# Altium project PROC154E3_SCH.PrjPcb (part 9 of 60)

## Sheet 16. SOC MCU OSPI0 FLASH.SchDoc: SOC - MCU OSPI FLASH
size 513 x 386 mm; Project: PROC154E2(001)_SK_AM69; Issue: 1.0; RevCode: E3; Page Create Date: March  8, 1995; Variant Name: Core Design; Schematic Page Number: 16; Page Number: 16; Page Size: C; Comment: MISTRAL_TITLEBLK_CSIZE_1; Page Count: 62; Schematic Page Count: 62; Name: PROC154E2 001 SK AM69; DsnPath: C:\Users\danie\Downloads\sprr466c\PROC154E3_RP\PROC154E3_SCH.DSN; SchematicName: SCHEMATIC1; PageName: 16. SOC MCU OSPI0 FLASH; PageSize: C; TopSchematic: True
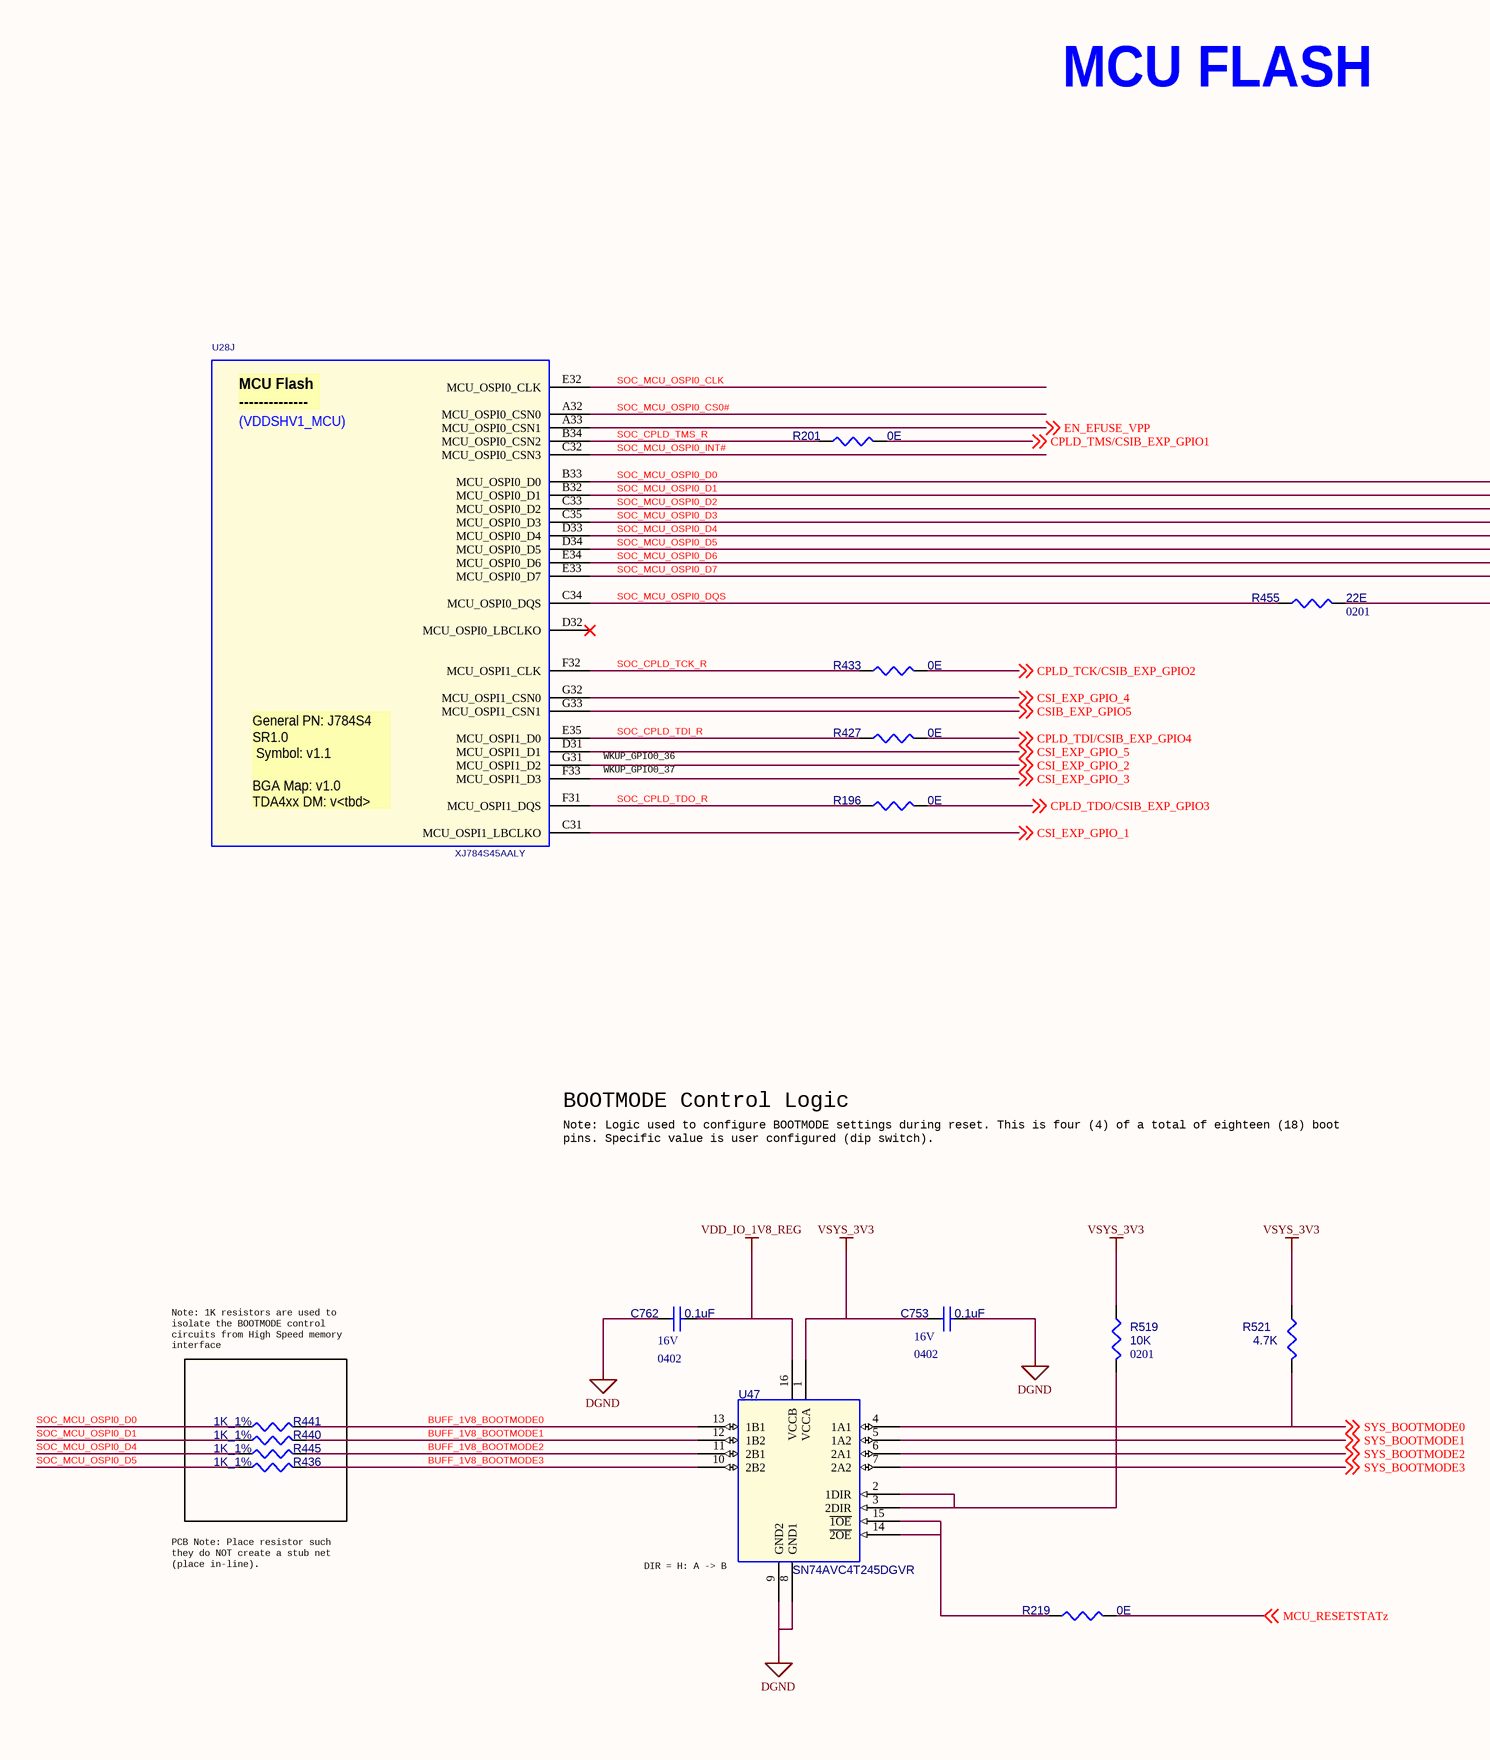
[diagram p22: 16. SOC MCU OSPI0 FLASH.SchDoc, left]
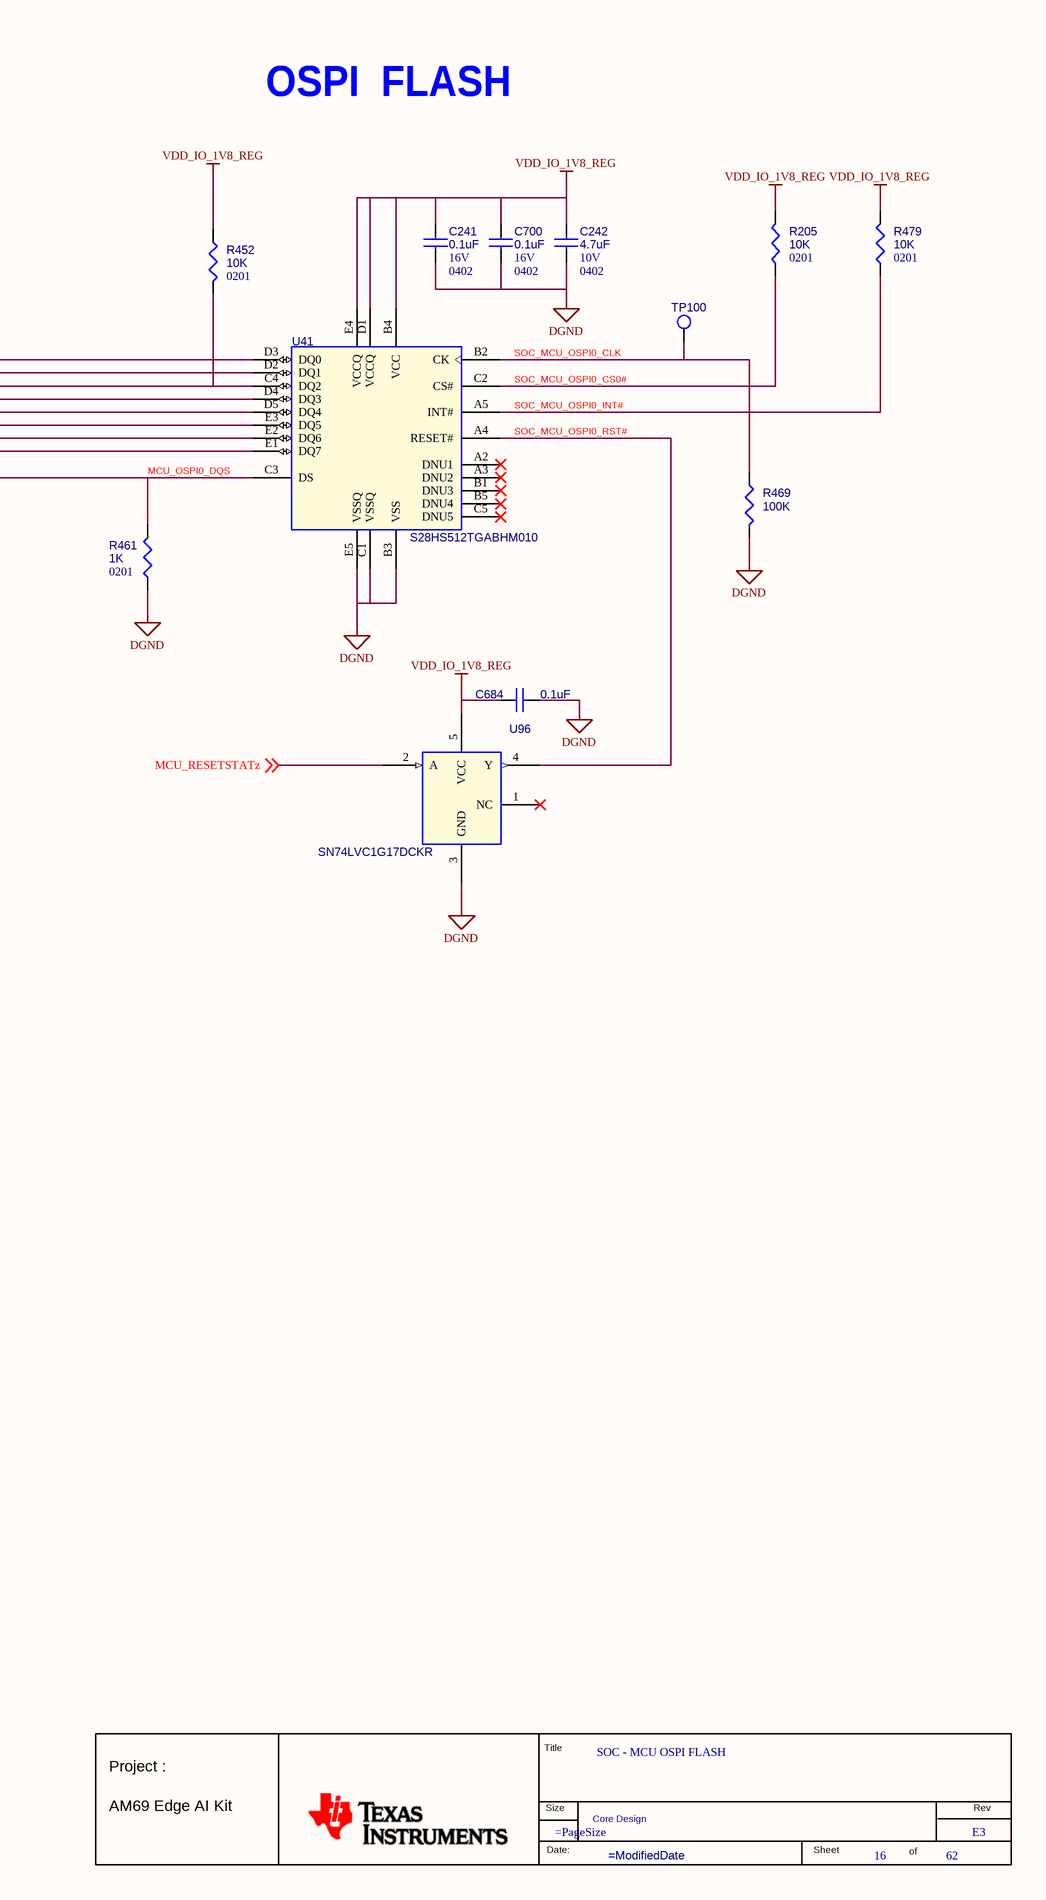
[diagram p23: 16. SOC MCU OSPI0 FLASH.SchDoc, right]

### Parts
(Parts that share a designator on the sheet are numbered #1, #2 ... from top to bottom, then left to right.)
*#16  RevCode: E3  Title: SOC - MCU OSPI FLASH  Page Number: 16  Page Count: 62  Variant Name: Core Design  (hidden comment: MISTRAL_TITLEBLK_CSIZE_1)  (graphical)
C241  0.1uF  Package: 0402  Voltage: 16V  [CAP0402_0-75]
C242  4.7uF  Voltage: 10V  Package: 0402  [CAP0402_0-75]
C684  0.1uF  [CAP0201_0-5]
C700  0.1uF  Voltage: 16V  Package: 0402  [CAP0402_0-75]
C753  0.1uF  Package: 0402  Voltage: 16V  [CAP0402_0-75]
C762  0.1uF  Package: 0402  Voltage: 16V  [CAP0402_0-75]
R196  0E  [RES0402_0-5]
R201  0E  [RES0402_0-5]
R205  10K  Package: 0201  [RES0201_0-5]
R219  0E  [RES0402_0-5]
R427  0E  [RES0402_0-5]
R433  0E  [RES0402_0-5]
R436  1K_1%  [RES0201_0-5]
R440  1K_1%  [RES0201_0-5]
R441  1K_1%  [RES0201_0-5]
R445  1K_1%  [RES0201_0-5]
R452  10K  Package: 0201  [RES0201_0-5]
R455  22E  Package: 0201  [RES0201_0-5]
R461  1K  Package: 0201  [RES0201_0-5]
R469  100K  [RES0402_0-5]
R479  10K  Package: 0201  [RES0201_0-5]
R519  10K  Package: 0201  [RES0201_0-5]
R521  4.7K  [RES0201_0-5]
TP100  TP30_SMD  [TP30_SMD]  (value not drawn)
U28  XJ784S45AALY  [BGA1414_31-49_1230X1230_2-7]  (part J of 26)
U41  S28HS512TGABHM010  [BGA24_39-37_240X310_1]
U47  SN74AVC4T245DGVR  [TVSOP16_15-74_150X180]
U96  SN74LVC1G17DCKR  [SC70-5]

### Nets
DGND: C241.2 C242.2 C684.2 C700.2 C753.2 C762.1 R461.1 R469.2 U41.B3(VSS) U41.C1(VSSQ) U41.E5(VSSQ) U47.8(GND1) U47.9(GND2) U96.3(GND)  [project net VDD_CPU_HCPS_GOSNS]
VDD_IO_1V8_REG: C241.1 C242.1 C684.1 C700.1 C762.2 R205.2 R452.1 R479.2 U41.B4(VCC) U41.D1(VCCQ) U41.E4(VCCQ) U47.16(VCCB) U96.5(VCC)
VSYS_3V3: C753.1 R519.1 R521.2 U47.1(VCCA)  [project net V_3V3]
BUFF_1V8_BOOTMODE0: R441.1 U47.13(1B1)
BUFF_1V8_BOOTMODE1: R440.1 U47.12(1B2)
BUFF_1V8_BOOTMODE2: R445.1 U47.11(2B1)
BUFF_1V8_BOOTMODE3: R436.1 U47.10(2B2)
CPLD_TCK/CSIB_EXP_GPIO2: R433.2 ; off-sheet CPLD_TCK/CSIB_EXP_GPIO2
CPLD_TDI/CSIB_EXP_GPIO4: R427.2 ; off-sheet CPLD_TDI/CSIB_EXP_GPIO4
CPLD_TDO/CSIB_EXP_GPIO3: R196.2 ; off-sheet CPLD_TDO/CSIB_EXP_GPIO3
CPLD_TMS/CSIB_EXP_GPIO1: R201.2 ; off-sheet CPLD_TMS/CSIB_EXP_GPIO1
CSI_EXP_GPIO_1: U28.C31(MCU_OSPI1_LBCLKO) ; off-sheet CSI_EXP_GPIO_1
CSI_EXP_GPIO_2: U28.G31(MCU_OSPI1_D2) ; off-sheet CSI_EXP_GPIO_2
CSI_EXP_GPIO_3: U28.F33(MCU_OSPI1_D3) ; off-sheet CSI_EXP_GPIO_3
CSI_EXP_GPIO_4: U28.G32(MCU_OSPI1_CSN0) ; off-sheet CSI_EXP_GPIO_4
CSI_EXP_GPIO_5: U28.D31(MCU_OSPI1_D1) ; off-sheet CSI_EXP_GPIO_5
CSIB_EXP_GPIO5: U28.G33(MCU_OSPI1_CSN1) ; off-sheet CSIB_EXP_GPIO5
EN_EFUSE_VPP: U28.A33(MCU_OSPI0_CSN1) ; off-sheet EN_EFUSE_VPP
MCU_OSPI0_DQS: R455.2 R461.2 U41.C3(DS)
MCU_RESETSTATZ: R219.2 U96.2(A) ; off-sheet MCU_RESETSTATz
SOC_CPLD_TCK_R: R433.1 U28.F32(MCU_OSPI1_CLK)
SOC_CPLD_TDI_R: R427.1 U28.E35(MCU_OSPI1_D0)
SOC_CPLD_TDO_R: R196.1 U28.F31(MCU_OSPI1_DQS)
SOC_CPLD_TMS_R: R201.1 U28.B34(MCU_OSPI0_CSN2)
SOC_MCU_OSPI0_CLK: R469.1 TP100.1(TP) U28.E32(MCU_OSPI0_CLK) U41.B2(CK)
SOC_MCU_OSPI0_CS0#: R205.1 U28.A32(MCU_OSPI0_CSN0) U41.C2(CS#)
SOC_MCU_OSPI0_D0: R441.2 U28.B33(MCU_OSPI0_D0) U41.D3(DQ0)
SOC_MCU_OSPI0_D1: R440.2 U28.B32(MCU_OSPI0_D1) U41.D2(DQ1)
SOC_MCU_OSPI0_D2: R452.2 U28.C33(MCU_OSPI0_D2) U41.C4(DQ2)
SOC_MCU_OSPI0_D3: U28.C35(MCU_OSPI0_D3) U41.D4(DQ3)
SOC_MCU_OSPI0_D4: R445.2 U28.D33(MCU_OSPI0_D4) U41.D5(DQ4)
SOC_MCU_OSPI0_D5: R436.2 U28.D34(MCU_OSPI0_D5) U41.E3(DQ5)
SOC_MCU_OSPI0_D6: U28.E34(MCU_OSPI0_D6) U41.E2(DQ6)
SOC_MCU_OSPI0_D7: U28.E33(MCU_OSPI0_D7) U41.E1(DQ7)
SOC_MCU_OSPI0_DQS: R455.1 U28.C34(MCU_OSPI0_DQS)
SOC_MCU_OSPI0_INT#: R479.1 U28.C32(MCU_OSPI0_CSN3) U41.A5(INT#)
SOC_MCU_OSPI0_RST#: U41.A4(RESET#) U96.4(Y)
SYS_BOOTMODE0: R521.1 U47.4(1A1) ; off-sheet SYS_BOOTMODE0
SYS_BOOTMODE1: U47.5(1A2) ; off-sheet SYS_BOOTMODE1
SYS_BOOTMODE2: U47.6(2A1) ; off-sheet SYS_BOOTMODE2
SYS_BOOTMODE3: U47.7(2A2) ; off-sheet SYS_BOOTMODE3
NetR219_1: R219.1 U47.14(~{2OE}) U47.15(~{1OE})
NetR519_2: R519.2 U47.2(1DIR) U47.3(2DIR)

Not connected (* = marked no-connect by the designer): U28 D32(MCU_OSPI0_LBCLKO)*; U41 A2(DNU1)* A3(DNU2)* B1(DNU3)* B5(DNU4)* C5(DNU5)*; U96 1(NC)*

### Notes on the sheet
- MCU FLASH
- OSPI  FLASH
- WKUP_GPIO0_36
- WKUP_GPIO0_37
- BOOTMODE Control Logic
- Note: Logic used to configure BOOTMODE settings during reset. This is four (4) of a total of eighteen (18) boot
  pins. Specific value is user configured (dip switch).
- Note: 1K resistors are used to
  isolate the BOOTMODE control
  circuits from High Speed memory
  interface
- PCB Note: Place resistor such
  they do NOT create a stub net
  (place in-line).
- (near U47) DIR = H: A -> B
- (in symbol J7AHPSoC-EVM_BGA1414, part J) MCU Flash / --------------; (VDDSHV1_MCU); General PN: J784S4 / SR1.0 / Symbol: v1.1 / BGA Map: v1.0 / TDA4xx DM: v<tbd>
- (in symbol MISTRAL_TITLEBLK_CSIZE_1) Title; Project :; Size; Rev; AM69 Edge AI Kit; Date:; Sheet; of

### Library data of the parts
*#16 = MISTRAL_TITLEBLK_CSIZE_1: Issue: 1.0; Project: PROC154E2(001)_SK_AM69; Name: PROC154E2 001 SK AM69; Page Create Date: March  8, 1995; Page Size: =PageSize; Page Modify Date: =ModifiedDate; Schematic Page Count: 62; Schematic Page Number: 16
C241 = CAP_Dup1: CAP CERAMIC 0.1uF 16V 10% X7R AUTO 0402; Part Reference: C241; Part_type: CAPACITORS\CERAMIC; Mfr_part_number: GCM155R71C104KA55D; Mfr_name: MURATA; Mistral Part No: 120016070006-R; Direct Alternate_mfr_part_number: GCM155R71C104JA55D; Automotive Alternate_mfr_name: TDK; Automotive Alternate_mfr_part_number: CGA2B1X7R1C104K050BC; Custom_Duty: 15%; Customs_HS_Code: 85322990; Wattage: NA; Project: DCMIST_FPGA_CARD; Value: 0.1uF; MECHANICAL 3D STEP FILE: CAP0402_0-75; Footprint Path: Y:\MIS_DATABASE\Library\ALTIUM_TOOL\PCB_FOOTPRINTS\Altium_Footprint_Lib.PcbLib; Library Path: Y:\MIS_DATABASE\Library\ALTIUM_TOOL\SCHEMATICS_PARTS\MS_DISCRETE_Library.schlib; Footprint Ref: CAP0402_0-75; Library Ref: CAP; Chkd/date: NAVEED/021014; Crtd /date: VASANTHA/300514; Datasheet: Y:\MIS_DATABASE\DATASHEETS\CAPACITORS\MURATA-GCM-SER.PDF; Temperature: -55°C+125°C; Weight: 6mg; Height: 0.55MM; Distributor_part_number: 490-4759-1-ND; Distributor_name: DIGIKEY; Tolerance: 10%; Direct Alternate_mfr_name: MURATA; PCB Footprint: CAP0402_0-75
C242 = CAP_Dup1: CAP CERAMIC 4.7uF 10V 20% X5R AUTO 0402; Part Reference: C242; Mistral Part No: 120021020032-R; Mfr_name: MURATA; Mfr_part_number: GRT155R61A475ME13D; Part_type: CAPACITORS\CERAMIC; Project: TI_DRA821 SK EVM BRD; Wattage: NA; Customs_HS_Code: 85322990; Custom_Duty: 15%; Value: 4.7uF; Footprint Path: Y:\MIS_DATABASE\Library\ALTIUM_TOOL\PCB_FOOTPRINTS\Altium_Footprint_Lib.PcbLib; Library Path: Y:\MIS_DATABASE\Library\ALTIUM_TOOL\SCHEMATICS_PARTS\MS_DISCRETE_Library.schlib; Footprint Ref: CAP0402_0-75; Tolerance: 20%; Distributor_name: MOUSER; Distributor_part_number: 81-GRT155R61A475ME13; Height: 0.65MM; Weight: 1.5mg; Temperature: -55°C+85°C; Datasheet: Y:\MIS_DATABASE\DATASHEETS\CAPACITORS\GRT155R61A475ME13.PDF; Crtd /date: ALVY/240221; Chkd/date: MANIRAJA/250221; MECHANICAL 3D STEP FILE: CAP0402_0-75; Library Ref: CAP; PCB Footprint: CAP0402_0-75
C684 = CAP_Dup1: CAP CERAMIC 0.1uF 16V 10% X7S AUTO 0201; Part Reference: C684; Mistral Part No: 120021030007-R; Mfr_name: MURATA; Mfr_part_number: GRT033C71C104KE01D; Part_type: CAPACITORS\CERAMIC; Project: J7ES_SK_BRD; Wattage: NA; Customs_HS_Code: 85322990; Custom_Duty: 15%; Value: 0.1uF; Tolerance: 10%; Voltage: 16V; Package: 0201; Distributor_name: DIGIKEY; Distributor_part_number: 490-GRT033C71C104KE01DTR-ND; Height: 0.33MM; Weight: 330mg; Temperature: -55°C+125°C; Datasheet: Y:\MIS_DATABASE\DATASHEETS\CAPACITORS\GRT033C71C104KE01.PDF; Crtd /date: ALVY/110321; Chkd/date: MANIRAJA/110321; MECHANICAL 3D STEP FILE: CAP0201_0-5; PCB Footprint: CAP0201_0-5
C700 = CAP_Dup1: CAP CERAMIC 0.1uF 16V 10% X7R AUTO 0402; Part Reference: C700; Mistral Part No: 120016070006-R; Mfr_name: MURATA; Mfr_part_number: GCM155R71C104KA55D; Part_type: CAPACITORS\CERAMIC; Direct Alternate_mfr_part_number: GCM155R71C104JA55D; Automotive Alternate_mfr_name: TDK; Automotive Alternate_mfr_part_number: CGA2B1X7R1C104K050BC; Project: DCMIST_FPGA_CARD; Wattage: NA; Customs_HS_Code: 85322990; Custom_Duty: 15%; Value: 0.1uF; MECHANICAL 3D STEP FILE: CAP0402_0-75; Tolerance: 10%; Distributor_name: DIGIKEY; Distributor_part_number: 490-4759-1-ND; Height: 0.55MM; Weight: 6mg; Temperature: -55°C+125°C; Datasheet: Y:\MIS_DATABASE\DATASHEETS\CAPACITORS\MURATA-GCM-SER.PDF; Crtd /date: VASANTHA/300514; Chkd/date: NAVEED/021014; Library Ref: CAP; Footprint Ref: CAP0402_0-75; Library Path: Y:\MIS_DATABASE\Library\ALTIUM_TOOL\SCHEMATICS_PARTS\MS_DISCRETE_Library.schlib; Footprint Path: Y:\MIS_DATABASE\Library\ALTIUM_TOOL\PCB_FOOTPRINTS\Altium_Footprint_Lib.PcbLib; Direct Alternate_mfr_name: MURATA; PCB Footprint: CAP0402_0-75
C753 = CAP_Dup1: CAP CERAMIC 0.1uF 16V 10% X7R AUTO 0402; Part Reference: C753; Automotive Alternate_mfr_part_number: CGA2B1X7R1C104K050BC; Automotive Alternate_mfr_name: TDK; Direct Alternate_mfr_part_number: GCM155R71C104JA55D; Direct Alternate_mfr_name: MURATA; Part_type: CAPACITORS\CERAMIC; Mfr_part_number: GCM155R71C104KA55D; Mistral Part No: 120016070006-R; Custom_Duty: 15%; Customs_HS_Code: 85322990; Wattage: NA; Project: DCMIST_FPGA_CARD; Value: 0.1uF; Footprint Path: Y:\MIS_DATABASE\Library\ALTIUM_TOOL\PCB_FOOTPRINTS\Altium_Footprint_Lib.PcbLib; Library Path: Y:\MIS_DATABASE\Library\ALTIUM_TOOL\SCHEMATICS_PARTS\MS_DISCRETE_Library.schlib; Footprint Ref: CAP0402_0-75; Library Ref: CAP; Chkd/date: NAVEED/021014; Crtd /date: VASANTHA/300514; Datasheet: Y:\MIS_DATABASE\DATASHEETS\CAPACITORS\MURATA-GCM-SER.PDF; Temperature: -55°C+125°C; Weight: 6mg; Height: 0.55MM; Distributor_part_number: 490-4759-1-ND; Distributor_name: DIGIKEY; Tolerance: 10%; Mfr_name: MURATA; MECHANICAL 3D STEP FILE: CAP0402_0-75; PCB Footprint: CAP0402_0-75
C762 = CAP_Dup1: CAP CERAMIC 0.1uF 16V 10% X7R AUTO 0402; Part Reference: C762; Part_type: CAPACITORS\CERAMIC; Mfr_part_number: GCM155R71C104KA55D; Mfr_name: MURATA; Mistral Part No: 120016070006-R; Direct Alternate_mfr_part_number: GCM155R71C104JA55D; Automotive Alternate_mfr_name: TDK; Automotive Alternate_mfr_part_number: CGA2B1X7R1C104K050BC; Custom_Duty: 15%; Customs_HS_Code: 85322990; Wattage: NA; Project: DCMIST_FPGA_CARD; Value: 0.1uF; MECHANICAL 3D STEP FILE: CAP0402_0-75; Footprint Path: Y:\MIS_DATABASE\Library\ALTIUM_TOOL\PCB_FOOTPRINTS\Altium_Footprint_Lib.PcbLib; Library Path: Y:\MIS_DATABASE\Library\ALTIUM_TOOL\SCHEMATICS_PARTS\MS_DISCRETE_Library.schlib; Footprint Ref: CAP0402_0-75; Library Ref: CAP; Chkd/date: NAVEED/021014; Crtd /date: VASANTHA/300514; Datasheet: Y:\MIS_DATABASE\DATASHEETS\CAPACITORS\MURATA-GCM-SER.PDF; Temperature: -55°C+125°C; Weight: 6mg; Height: 0.55MM; Distributor_part_number: 490-4759-1-ND; Distributor_name: DIGIKEY; Tolerance: 10%; Direct Alternate_mfr_name: MURATA; PCB Footprint: CAP0402_0-75
R196 = RESISTOR_Dup1: RES 0E 1/10W JUMPER 0402; Part Reference: R196; Mistral Part No: 110018030052-R; Mfr_name: PANASONIC-ECG; Mfr_part_number: ERJ-2GE0R00X; Part_type: RESISTORS\FIXED; Project: AEGIS POM; Tolerance: NA; Customs_HS_Code: 85332119; Custom_Duty: 15%; Value: 0E; MECHANICAL 3D STEP FILE: RES0402_0-5; Voltage: NA; Wattage: 1/10W; Package: 0402; Distributor_name: DIGIKEY; Distributor_part_number: P0.0JCT-ND; Height: 0.40MM; Weight: 0.8mg; Temperature: -55°C+155°C; Datasheet: Y:\MIS_DATABASE\DATASHEETS\RESISTORS\PAN-ERJSER_NOV17.PDF; Crtd /date: NAVEED/201014; Chkd/date: VASANTHA/061216; Library Ref: RESISTOR; Footprint Ref: RES0402_0-5; Library Path: Y:\MIS_DATABASE\Library\ALTIUM_TOOL\SCHEMATICS_PARTS\MS_DISCRETE_Library.schlib; Footprint Path: Y:\MIS_DATABASE\Library\ALTIUM_TOOL\PCB_FOOTPRINTS\Altium_Footprint_Lib.PcbLib; PCB Footprint: RES0402_0-5
R201 = RESISTOR_Dup1: RES 0E 1/10W JUMPER 0402; Part Reference: R201; Part_type: RESISTORS\FIXED; Mfr_part_number: ERJ-2GE0R00X; Mfr_name: PANASONIC-ECG; Mistral Part No: 110018030052-R; Custom_Duty: 15%; Customs_HS_Code: 85332119; Voltage: NA; Project: AEGIS POM; Value: 0E; Footprint Path: Y:\MIS_DATABASE\Library\ALTIUM_TOOL\PCB_FOOTPRINTS\Altium_Footprint_Lib.PcbLib; Library Path: Y:\MIS_DATABASE\Library\ALTIUM_TOOL\SCHEMATICS_PARTS\MS_DISCRETE_Library.schlib; Footprint Ref: RES0402_0-5; Library Ref: RESISTOR; Chkd/date: VASANTHA/061216; Crtd /date: NAVEED/201014; Datasheet: Y:\MIS_DATABASE\DATASHEETS\RESISTORS\PAN-ERJSER_NOV17.PDF; Temperature: -55°C+155°C; Weight: 0.8mg; Height: 0.40MM; Distributor_part_number: P0.0JCT-ND; Distributor_name: DIGIKEY; Package: 0402; Wattage: 1/10W; Tolerance: NA; MECHANICAL 3D STEP FILE: RES0402_0-5; PCB Footprint: RES0402_0-5
R205 = RESISTOR_Dup2: RES 10K 1/20W 5% 0201; Part Reference: R205; Mistral Part No: 110010070051-R; Mfr_name: YAGEO AMERICA; Mfr_part_number: RC0201JR-0710KL; Part_type: RESISTORS\FIXED; Project: GOLDEN-I LITE; Voltage: NA; Customs_HS_Code: 85332119; Custom_Duty: 15%; Value: 10K; Tolerance: 5%; Wattage: 1/20W; Distributor_name: DIGIKEY; Distributor_part_number: 311-10KNCT-ND; Height: 0.26MM; Weight: 0.17mg; Temperature: -55°C+125°C; Datasheet: Y:\MIS_DATABASE\DATASHEETS\RESISTORS\RCXXXXL-SER_MAR18.PDF; Crtd /date: MANIRAJA/050517; Chkd/date: MANIRAJA/050517; MECHANICAL 3D STEP FILE: RES0201_0-5; Library Ref: RESISTOR; Footprint Ref: RES0201_0-5; Library Path: Y:\MIS_DATABASE\Library\ALTIUM_TOOL\SCHEMATICS_PARTS\MS_DISCRETE_Library.schlib; Footprint Path: Y:\MIS_DATABASE\Library\ALTIUM_TOOL\PCB_FOOTPRINTS\Altium_Footprint_Lib.PcbLib; PCB Footprint: RES0201_0-5
R219 = RESISTOR_Dup1: RES 0E 1/10W JUMPER 0402; Part Reference: R219; Mistral Part No: 110018030052-R; Mfr_name: PANASONIC-ECG; Mfr_part_number: ERJ-2GE0R00X; Part_type: RESISTORS\FIXED; Project: AEGIS POM; Tolerance: NA; Customs_HS_Code: 85332119; Custom_Duty: 15%; Value: 0E; MECHANICAL 3D STEP FILE: RES0402_0-5; Voltage: NA; Wattage: 1/10W; Package: 0402; Distributor_name: DIGIKEY; Distributor_part_number: P0.0JCT-ND; Height: 0.40MM; Weight: 0.8mg; Temperature: -55°C+155°C; Datasheet: Y:\MIS_DATABASE\DATASHEETS\RESISTORS\PAN-ERJSER_NOV17.PDF; Crtd /date: NAVEED/201014; Chkd/date: VASANTHA/061216; Library Ref: RESISTOR; Footprint Ref: RES0402_0-5; Library Path: Y:\MIS_DATABASE\Library\ALTIUM_TOOL\SCHEMATICS_PARTS\MS_DISCRETE_Library.schlib; Footprint Path: Y:\MIS_DATABASE\Library\ALTIUM_TOOL\PCB_FOOTPRINTS\Altium_Footprint_Lib.PcbLib; PCB Footprint: RES0402_0-5
R427 = RESISTOR_Dup1: RES 0E 1/10W JUMPER 0402; Part Reference: R427; Mistral Part No: 110018030052-R; Mfr_name: PANASONIC-ECG; Mfr_part_number: ERJ-2GE0R00X; Part_type: RESISTORS\FIXED; Project: AEGIS POM; Tolerance: NA; Customs_HS_Code: 85332119; Custom_Duty: 15%; Value: 0E; MECHANICAL 3D STEP FILE: RES0402_0-5; Voltage: NA; Wattage: 1/10W; Package: 0402; Distributor_name: DIGIKEY; Distributor_part_number: P0.0JCT-ND; Height: 0.40MM; Weight: 0.8mg; Temperature: -55°C+155°C; Datasheet: Y:\MIS_DATABASE\DATASHEETS\RESISTORS\PAN-ERJSER_NOV17.PDF; Crtd /date: NAVEED/201014; Chkd/date: VASANTHA/061216; Library Ref: RESISTOR; Footprint Ref: RES0402_0-5; Library Path: Y:\MIS_DATABASE\Library\ALTIUM_TOOL\SCHEMATICS_PARTS\MS_DISCRETE_Library.schlib; Footprint Path: Y:\MIS_DATABASE\Library\ALTIUM_TOOL\PCB_FOOTPRINTS\Altium_Footprint_Lib.PcbLib; PCB Footprint: RES0402_0-5
R433 = RESISTOR_Dup1: RES 0E 1/10W JUMPER 0402; Part Reference: R433; Part_type: RESISTORS\FIXED; Mfr_part_number: ERJ-2GE0R00X; Mfr_name: PANASONIC-ECG; Mistral Part No: 110018030052-R; Custom_Duty: 15%; Customs_HS_Code: 85332119; Voltage: NA; Project: AEGIS POM; Value: 0E; Footprint Path: Y:\MIS_DATABASE\Library\ALTIUM_TOOL\PCB_FOOTPRINTS\Altium_Footprint_Lib.PcbLib; Library Path: Y:\MIS_DATABASE\Library\ALTIUM_TOOL\SCHEMATICS_PARTS\MS_DISCRETE_Library.schlib; Footprint Ref: RES0402_0-5; Library Ref: RESISTOR; Chkd/date: VASANTHA/061216; Crtd /date: NAVEED/201014; Datasheet: Y:\MIS_DATABASE\DATASHEETS\RESISTORS\PAN-ERJSER_NOV17.PDF; Temperature: -55°C+155°C; Weight: 0.8mg; Height: 0.40MM; Distributor_part_number: P0.0JCT-ND; Distributor_name: DIGIKEY; Package: 0402; Wattage: 1/10W; Tolerance: NA; MECHANICAL 3D STEP FILE: RES0402_0-5; PCB Footprint: RES0402_0-5
R436 = RESISTOR_Dup1: RES 1K 1/20W 1% 0201; Part Reference: R436; Mistral Part No: 110015080014-R; Mfr_name: KOA SPEER; Mfr_part_number: RK73H1HTTC1001F; Part_type: RESISTORS\FIXED; Voltage: NA; Project: HMC; Customs_HS_Code: 85332119; Custom_Duty: 15%; Value: 1K_1%; Footprint Path: Y:\MIS_DATABASE\Library\ALTIUM_TOOL\PCB_FOOTPRINTS\Altium_Footprint_Lib.PcbLib; Library Path: Y:\MIS_DATABASE\Library\ALTIUM_TOOL\SCHEMATICS_PARTS\MS_DISCRETE_Library.schlib; MECHANICAL 3D STEP FILE: RES0201_0-5; Footprint Ref: RES0201_0-5; Tolerance: 1%; Wattage: 1/20W; Package: 0201; Distributor_name: MOUSER; Distributor_part_number: 660-RK73H1HTTC1001F; Height: 0.26MM; Weight: 0.17mg; Temperature: -55°C+155°C; Datasheet: Y:\MIS_DATABASE\DATASHEETS\RESISTORS\RK73H-SER.PDF; Crtd /date: MAZHAR/100511; Chkd/date: RAGESH/120511; Library Ref: RESISTOR; Manufacturer: KOA SPEER; PCB Footprint: RES0201_0-5
R440 = RESISTOR_Dup1: RES 1K 1/20W 1% 0201; Part Reference: R440; Manufacturer: KOA SPEER; Part_type: RESISTORS\FIXED; Mfr_part_number: RK73H1HTTC1001F; Mistral Part No: 110015080014-R; Custom_Duty: 15%; Customs_HS_Code: 85332119; Project: HMC; Voltage: NA; Value: 1K_1%; Library Ref: RESISTOR; Chkd/date: RAGESH/120511; Crtd /date: MAZHAR/100511; Datasheet: Y:\MIS_DATABASE\DATASHEETS\RESISTORS\RK73H-SER.PDF; Temperature: -55°C+155°C; Weight: 0.17mg; Height: 0.26MM; Distributor_part_number: 660-RK73H1HTTC1001F; Distributor_name: MOUSER; Package: 0201; Wattage: 1/20W; Tolerance: 1%; Mfr_name: KOA SPEER; Footprint Ref: RES0201_0-5; MECHANICAL 3D STEP FILE: RES0201_0-5; Library Path: Y:\MIS_DATABASE\Library\ALTIUM_TOOL\SCHEMATICS_PARTS\MS_DISCRETE_Library.schlib; Footprint Path: Y:\MIS_DATABASE\Library\ALTIUM_TOOL\PCB_FOOTPRINTS\Altium_Footprint_Lib.PcbLib; PCB Footprint: RES0201_0-5
R441 = RESISTOR_Dup1: RES 1K 1/20W 1% 0201; Part Reference: R441; Manufacturer: KOA SPEER; Mistral Part No: 110015080014-R; Mfr_part_number: RK73H1HTTC1001F; Part_type: RESISTORS\FIXED; Voltage: NA; Project: HMC; Customs_HS_Code: 85332119; Custom_Duty: 15%; Value: 1K_1%; Footprint Path: Y:\MIS_DATABASE\Library\ALTIUM_TOOL\PCB_FOOTPRINTS\Altium_Footprint_Lib.PcbLib; Library Path: Y:\MIS_DATABASE\Library\ALTIUM_TOOL\SCHEMATICS_PARTS\MS_DISCRETE_Library.schlib; MECHANICAL 3D STEP FILE: RES0201_0-5; Footprint Ref: RES0201_0-5; Mfr_name: KOA SPEER; Tolerance: 1%; Wattage: 1/20W; Package: 0201; Distributor_name: MOUSER; Distributor_part_number: 660-RK73H1HTTC1001F; Height: 0.26MM; Weight: 0.17mg; Temperature: -55°C+155°C; Datasheet: Y:\MIS_DATABASE\DATASHEETS\RESISTORS\RK73H-SER.PDF; Crtd /date: MAZHAR/100511; Chkd/date: RAGESH/120511; Library Ref: RESISTOR; PCB Footprint: RES0201_0-5
R445 = RESISTOR_Dup1: RES 1K 1/20W 1% 0201; Part Reference: R445; Manufacturer: KOA SPEER; Part_type: RESISTORS\FIXED; Mfr_part_number: RK73H1HTTC1001F; Mistral Part No: 110015080014-R; Custom_Duty: 15%; Customs_HS_Code: 85332119; Project: HMC; Voltage: NA; Value: 1K_1%; Library Ref: RESISTOR; Chkd/date: RAGESH/120511; Crtd /date: MAZHAR/100511; Datasheet: Y:\MIS_DATABASE\DATASHEETS\RESISTORS\RK73H-SER.PDF; Temperature: -55°C+155°C; Weight: 0.17mg; Height: 0.26MM; Distributor_part_number: 660-RK73H1HTTC1001F; Distributor_name: MOUSER; Package: 0201; Wattage: 1/20W; Tolerance: 1%; Mfr_name: KOA SPEER; Footprint Ref: RES0201_0-5; MECHANICAL 3D STEP FILE: RES0201_0-5; Library Path: Y:\MIS_DATABASE\Library\ALTIUM_TOOL\SCHEMATICS_PARTS\MS_DISCRETE_Library.schlib; Footprint Path: Y:\MIS_DATABASE\Library\ALTIUM_TOOL\PCB_FOOTPRINTS\Altium_Footprint_Lib.PcbLib; PCB Footprint: RES0201_0-5
R452 = RESISTOR_Dup2: RES 10K 1/20W 5% 0201; Part Reference: R452; Mistral Part No: 110010070051-R; Mfr_name: YAGEO AMERICA; Mfr_part_number: RC0201JR-0710KL; Part_type: RESISTORS\FIXED; Project: GOLDEN-I LITE; Voltage: NA; Customs_HS_Code: 85332119; Custom_Duty: 15%; Value: 10K; Footprint Ref: RES0201_0-5; Tolerance: 5%; Wattage: 1/20W; Distributor_name: DIGIKEY; Distributor_part_number: 311-10KNCT-ND; Library Ref: RESISTOR; Height: 0.26MM; Weight: 0.17mg; Temperature: -55°C+125°C; Datasheet: Y:\MIS_DATABASE\DATASHEETS\RESISTORS\RCXXXXL-SER_MAR18.PDF; Crtd /date: MANIRAJA/050517; Chkd/date: MANIRAJA/050517; MECHANICAL 3D STEP FILE: RES0201_0-5; Library Path: Y:\MIS_DATABASE\Library\ALTIUM_TOOL\SCHEMATICS_PARTS\MS_DISCRETE_Library.schlib; Footprint Path: Y:\MIS_DATABASE\Library\ALTIUM_TOOL\PCB_FOOTPRINTS\Altium_Footprint_Lib.PcbLib; PCB Footprint: RES0201_0-5
R455 = RESISTOR_Dup2: RES 22E 1/20W 5% 0201; Part Reference: R455; Mistral Part No: 110020050041-R; Mfr_name: PANASONIC-ECG; Mfr_part_number: ERJ-1GNJ220C; Part_type: RESISTORS\FIXED; Project: QCS610_NANOSOM; Voltage: NA; Customs_HS_Code: 85332119; Custom_Duty: 15%; SIGNAL_MODEL: RESISTOR_RES0201_0-5_22E_22E; Value: 22E; Footprint Ref: RES0201_0-5; Tolerance: 5%; Wattage: 1/20W; Distributor_name: DIGIKEY; Distributor_part_number: P123275CT-ND; Library Ref: RESISTOR; Height: 0.26MM; Weight: 0.15mg; Temperature: -55°C+125°C; Datasheet: Y:\MIS_DATABASE\DATASHEETS\RESISTORS\PAN-ERJSER_NOV17.PDF; Crtd /date: ALVY/250520; Chkd/date: MANIRAJA/300520; MECHANICAL 3D STEP FILE: RES0201_0-5; Library Path: Y:\MIS_DATABASE\Library\ALTIUM_TOOL\SCHEMATICS_PARTS\MS_DISCRETE_Library.schlib; Footprint Path: Y:\MIS_DATABASE\Library\ALTIUM_TOOL\PCB_FOOTPRINTS\Altium_Footprint_Lib.PcbLib; PCB Footprint: RES0201_0-5
R461 = RESISTOR_Dup1: RES 1K 1/20W 5% 0201; Part Reference: R461; Part_type: RESISTORS\FIXED; Mfr_part_number: RC0201JR-071KL; Mfr_name: YAGEO AMERICA; Mistral Part No: 110009030395-R; Custom_Duty: 15%; Customs_HS_Code: 85332119; Project: GOLDEN-I LITE; Voltage: NA; Value: 1K; Library Ref: RESISTOR; Chkd/date: MANIRAJA/050517; Crtd /date: MANIRAJA/050517; Datasheet: Y:\MIS_DATABASE\DATASHEETS\RESISTORS\RCXXXXL-SER_MAR18.PDF; Temperature: -55°C+125°C; Weight: 0.17mg; Height: 0.26MM; Distributor_part_number: 311-1KNCT-ND; Distributor_name: DIGIKEY; Wattage: 1/20W; Tolerance: 5%; Footprint Ref: RES0201_0-5; MECHANICAL 3D STEP FILE: RES0201_0-5; Library Path: Y:\MIS_DATABASE\Library\ALTIUM_TOOL\SCHEMATICS_PARTS\MS_DISCRETE_Library.schlib; Footprint Path: Y:\MIS_DATABASE\Library\ALTIUM_TOOL\PCB_FOOTPRINTS\Altium_Footprint_Lib.PcbLib; PCB Footprint: RES0201_0-5
R469 = RESISTOR_Dup2: RES 100K 1/10W 5% 0402; Part Reference: R469; Mistral Part No: 110009030177-R; Mfr_name: PANASONIC-ECG; Mfr_part_number: ERJ-2GEJ104X; Part_type: RESISTORS\FIXED; Project: RED EYE; Voltage: NA; Customs_HS_Code: 85332119; Custom_Duty: 15%; Value: 100K; Footprint Ref: RES0402_0-5; Tolerance: 5%; Wattage: 1/10W; Package: 0402; Distributor_name: DIGIKEY; Distributor_part_number: P100KJCT-ND; Library Ref: RESISTOR; Height: 0.40MM; Weight: 0.8mg; Temperature: -55°C+155°C; Datasheet: Y:\MIS_DATABASE\DATASHEETS\RESISTORS\PAN-ERJSER_NOV17.PDF; Crtd /date: GEETHA/190406; Chkd/date: VASANTHA/291216; MECHANICAL 3D STEP FILE: RES0402_0-5; Library Path: Y:\MIS_DATABASE\Library\ALTIUM_TOOL\SCHEMATICS_PARTS\MS_DISCRETE_Library.schlib; Footprint Path: Y:\MIS_DATABASE\Library\ALTIUM_TOOL\PCB_FOOTPRINTS\Altium_Footprint_Lib.PcbLib; PCB Footprint: RES0402_0-5
R479 = RESISTOR_Dup2: RES 10K 1/20W 5% 0201; Part Reference: R479; Part_type: RESISTORS\FIXED; Mfr_part_number: RC0201JR-0710KL; Mfr_name: YAGEO AMERICA; Mistral Part No: 110010070051-R; Custom_Duty: 15%; Customs_HS_Code: 85332119; Voltage: NA; Project: GOLDEN-I LITE; Value: 10K; Footprint Path: Y:\MIS_DATABASE\Library\ALTIUM_TOOL\PCB_FOOTPRINTS\Altium_Footprint_Lib.PcbLib; Library Path: Y:\MIS_DATABASE\Library\ALTIUM_TOOL\SCHEMATICS_PARTS\MS_DISCRETE_Library.schlib; Footprint Ref: RES0201_0-5; Library Ref: RESISTOR; MECHANICAL 3D STEP FILE: RES0201_0-5; Chkd/date: MANIRAJA/050517; Crtd /date: MANIRAJA/050517; Datasheet: Y:\MIS_DATABASE\DATASHEETS\RESISTORS\RCXXXXL-SER_MAR18.PDF; Temperature: -55°C+125°C; Weight: 0.17mg; Height: 0.26MM; Distributor_part_number: 311-10KNCT-ND; Distributor_name: DIGIKEY; Wattage: 1/20W; Tolerance: 5%; PCB Footprint: RES0201_0-5
R519 = RESISTOR_Dup2: RES 10K 1/20W 5% 0201; Part Reference: R519; Part_type: RESISTORS\FIXED; Mfr_part_number: RC0201JR-0710KL; Mfr_name: YAGEO AMERICA; Mistral Part No: 110010070051-R; Custom_Duty: 15%; Customs_HS_Code: 85332119; Voltage: NA; Project: GOLDEN-I LITE; Value: 10K; Footprint Path: Y:\MIS_DATABASE\Library\ALTIUM_TOOL\PCB_FOOTPRINTS\Altium_Footprint_Lib.PcbLib; Library Path: Y:\MIS_DATABASE\Library\ALTIUM_TOOL\SCHEMATICS_PARTS\MS_DISCRETE_Library.schlib; MECHANICAL 3D STEP FILE: RES0201_0-5; Chkd/date: MANIRAJA/050517; Crtd /date: MANIRAJA/050517; Datasheet: Y:\MIS_DATABASE\DATASHEETS\RESISTORS\RCXXXXL-SER_MAR18.PDF; Temperature: -55°C+125°C; Weight: 0.17mg; Height: 0.26MM; Library Ref: RESISTOR; Distributor_part_number: 311-10KNCT-ND; Distributor_name: DIGIKEY; Wattage: 1/20W; Tolerance: 5%; Footprint Ref: RES0201_0-5; PCB Footprint: RES0201_0-5
R521 = RESISTOR_Dup2: RES 4.7K 1/20W 5% 0201; Part Reference: R521; Part_type: RESISTORS\FIXED; Mfr_part_number: ERJ-1GNJ472C; Mfr_name: PANASONIC-ECG; Mistral Part No: 110010070061-R; Custom_Duty: 15%; Customs_HS_Code: 85332119; Voltage: NA; Project: CUSTOM DCA1000; Value: 4.7K; Footprint Path: Y:\MIS_DATABASE\Library\ALTIUM_TOOL\PCB_FOOTPRINTS\Altium_Footprint_Lib.PcbLib; Library Path: Y:\MIS_DATABASE\Library\ALTIUM_TOOL\SCHEMATICS_PARTS\MS_DISCRETE_Library.schlib; MECHANICAL 3D STEP FILE: RES0201_0-5; Chkd/date: MANIRAJA/170420; Crtd /date: ALVY/170420; Datasheet: Y:\MIS_DATABASE\DATASHEETS\RESISTORS\PAN-ERJSER_NOV17.PDF; Temperature: -55°C+125°C; Weight: 0.15mg; Height: 0.26MM; Library Ref: RESISTOR; Distributor_part_number: P4.7AECT-ND; Distributor_name: DIGIKEY; Package: 0201; Wattage: 1/20W; Tolerance: 5%; Footprint Ref: RES0201_0-5; PCB Footprint: RES0201_0-5
TP100 = TESTPOINT_Dup1: TESTPOINT CIR 30 SMD; Part Reference: TP100; Mfr_name: LOCAL; Mistral Part No: 130009030930; Custom_Duty: NA; Project: BT MODULE_CSRBC04; Value: TP30_SMD; Customs_HS_Code: NA; RoHS: NA; Footprint Path: Y:\MIS_DATABASE\Library\ALTIUM_TOOL\PCB_FOOTPRINTS\Altium_Footprint_Lib.PcbLib; Library Path: Y:\MIS_DATABASE\Library\ALTIUM_TOOL\SCHEMATICS_PARTS\MS_DISCRETE_Library.schlib; MECHANICAL 3D STEP FILE: NA; Chkd/date: SHREESHAIL/171006; Crtd /date: MAZHAR/171006; Datasheet: NA; Temperature: NA; Weight: NA; Height: NA; Distributor_part_number: NA; Distributor_name: NA; Package: SMD; Wattage: NA; Voltage: NA; Tolerance: NA; Part_type: TESTPOINT; Mfr_part_number: TP30_SMD; Library Ref: TESTPOINT; Footprint Ref: TP30_SMD; PCB Footprint: TP30_SMD
U28 = J7AHPSoC-EVM_BGA1414: IC AM69 SoC EVM MICROPROCESSOR BGA1414; Part Reference: U28; Part_type: ICS\DIGITAL\MICROPROCESSOR; Mfr_name: TEXAS INSTRUMENTS; Mistral Part No: 141230020002; SPLIT_INST: TRUE; SWAP_INFO: (S1+S2+S3+S4+S5+S6+S7+S8+S9+S10+S11+S12+S13+S14+S15+S16+S17+S18+S19+S20+S21+S22+S23+S24+S25+S26); Custom_Duty: 15%; Customs_HS_Code: 85423100; Wattage: NA; Project: TI_J7AHP SK_BRD; Value: XJ784S45AALY; Footprint Path: Y:\MIS_DATABASE\Library\ALTIUM_TOOL\PCB_FOOTPRINTS\Altium_Footprint_Lib.PcbLib; Library Path: Y:\MIS_DATABASE\Library\ALTIUM_TOOL\SCHEMATICS_PARTS\MS_MICROPROCESSOR_Library.schlib; MECHANICAL 3D STEP FILE: BGA1414_31-49_1230X1230_2-7; RoHS: NA; Chkd/date: MANIRAJA/151221; Crtd /date: ALVY/141221; Datasheet: Y:\MIS_DATABASE\DATASHEETS\ICS\DIGITAL\MICROCONTROLLER\J7AHP-SoC-EVM.PDF; Temperature: NA; Weight: NA; Height: 2.70MM; Library Ref: J7AHPSoC-EVM_BGA1414; Distributor_part_number: NA; Distributor_name: NA; Package: BGA1414; Voltage: NA; Tolerance: NA; Mfr_part_number: XJ784S45AALY; Footprint Ref: BGA1414_31-49_1230X1230_2-7; Manufacturer: TEXAS INSTRUMENTS; PCB Footprint: BGA1414_31-49_1230X1230_2-7
U41 = S28HS512T_BGA24: IC 1.8V 512Mb SEMPER FLASH WITH OCTAL INTERFACE BGA24; Part Reference: U41; Part_type: ICS\DIGITAL\MEMORY; Mfr_name: CYPRESS SEMICONDUCTOR; Mistral Part No: 141120010002; Custom_Duty: 15%; Customs_HS_Code: 85423100; Wattage: NA; Project: J7VCL_SOM DUAL LEO PMIC; Value: S28HS512TGABHM010; Footprint Path: Y:\MIS_DATABASE\Library\ALTIUM_TOOL\PCB_FOOTPRINTS\Altium_Footprint_Lib.PcbLib; Library Path: Y:\MIS_DATABASE\Library\ALTIUM_TOOL\SCHEMATICS_PARTS\MS_MISCMEMORY_Library.schlib; MECHANICAL 3D STEP FILE: BGA24_39-37_240X310_1; RoHS: NA; Chkd/date: MANIRAJA/170120; Crtd /date: ALVY/170120; Datasheet: Y:\MIS_DATABASE\DATASHEETS\ICS\MEMORY\S28HS512T.PDF; Temperature: -40°C+125°C; Weight: NA; Height: 1.00MM; Library Ref: S28HS512T_BGA24; Distributor_part_number: NA; Distributor_name: NA; Package: BGA24; Voltage: NA; Tolerance: NA; Mfr_part_number: S28HS512TGABHM010; Footprint Ref: BGA24_39-37_240X310_1; PCB Footprint: BGA24_39-37_240X310_1
U47 = SN74AVC4T245DGVR_TVSOP16: IC 4-BIT DUAL SUPPLY BUS TRANSCEIVER TVSOP16; Part Reference: U47; Part_type: ICS\DIGITAL\COMBINATIONAL; Mfr_name: TEXAS INSTRUMENTS; Mistral Part No: 141009110005-P; Custom_Duty: 15%; Customs_HS_Code: 85423100; Project: GOLDEN-I; Value: SN74AVC4T245DGVR; RoHS: Sb/ Br FREE; Chkd/date: SUHAS/251010; Crtd /date: MAZHAR/201109; Datasheet: Y:\MIS_DATABASE\DATASHEETS\ICS\DIGITAL\BUSTRANSCEIVER\SN74AVC4T245.PDF; Temperature: -40°C+85°C; Height: 1.20MM; Library Ref: SN74AVC4T245DGVR_TVSOP16; Distributor_part_number: 296-18054-1-ND; Distributor_name: DIGIKEY; Package: TVSOP16; Mfr_part_number: SN74AVC4T245DGVR; PCB Footprint: TVSOP16_15-74_150X180
U96 = SN74LVC1G17DCKR_SC70-5: IC SINGLE SCHMITT-TRIGGER BUFFER SC70-5; Part Reference: U96; Part_type: ICS\DIGITAL\COMBINATIONAL; Mfr_name: TEXAS INSTRUMENTS; Mistral Part No: 141010110012-R; Automotive Alternate_mfr_part_number: SN74LVC1G17QDCKRQ1; Custom_Duty: 15%; Customs_HS_Code: 85423100; Wattage: NA; Project: ITS-PWR_CARD; Value: SN74LVC1G17DCKR; Chkd/date: MAZHAR/011210; Crtd /date: BAVISH/251110; Datasheet: Y:\MIS_DATABASE\DATASHEETS\ICS\DIGITAL\COMBINATIONAL\SN74LVC1G17DCK.PDF; Temperature: -40°C+85°C; Weight: NA; Height: 1.10MM; Library Ref: SN74LVC1G17DCKR_SC70-5; Distributor_part_number: 296-11934-1-ND; Distributor_name: DIGIKEY; Package: SC70-5; Voltage: NA; Tolerance: NA; Mfr_part_number: SN74LVC1G17DCKR; Automotive Alternate_mfr_name: TEXAS INSTRUMENTS; PCB Footprint: SC70-5

## Sheet 17. SOC MCU & MAIN GEN IO, OSC.SchDoc: SOC - MCU GENERAL & MAIN GENERAL
size 513 x 386 mm; Project: PROC154E2(001)_SK_AM69; Issue: 1.0; RevCode: E3; Page Create Date: March  8, 1995; Variant Name: Core Design; Schematic Page Number: 17; Page Number: 17; Page Size: C; Comment: MISTRAL_TITLEBLK_CSIZE_1; Page Count: 62; Schematic Page Count: 62; Name: PROC154E2 001 SK AM69; DsnPath: C:\Users\danie\Downloads\sprr466c\PROC154E3_RP\PROC154E3_SCH.DSN; SchematicName: SCHEMATIC1; PageName: 17. SOC MCU & MAIN GEN IO, OSC; PageSize: C; TopSchematic: True
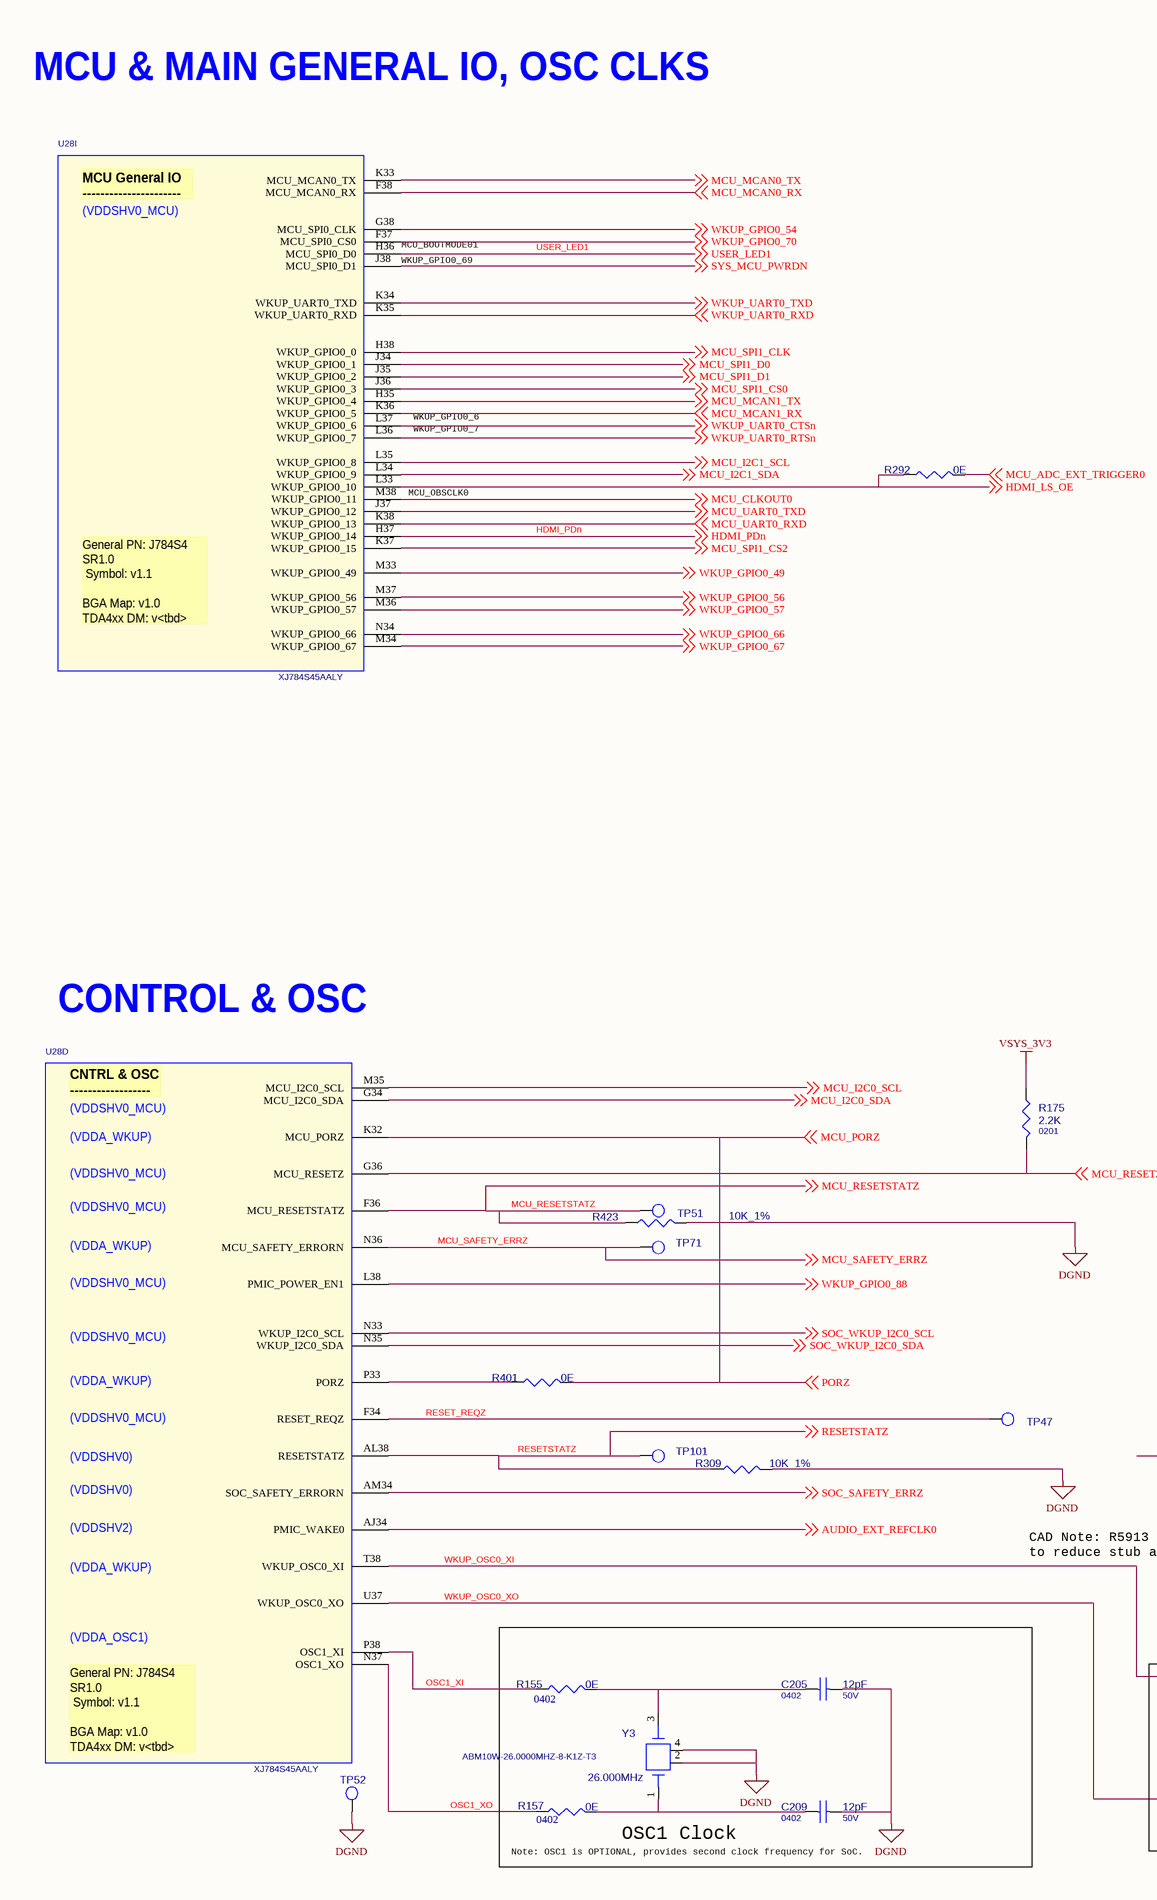
[diagram p24: 17. SOC MCU & MAIN GEN IO, OSC.SchDoc, left]
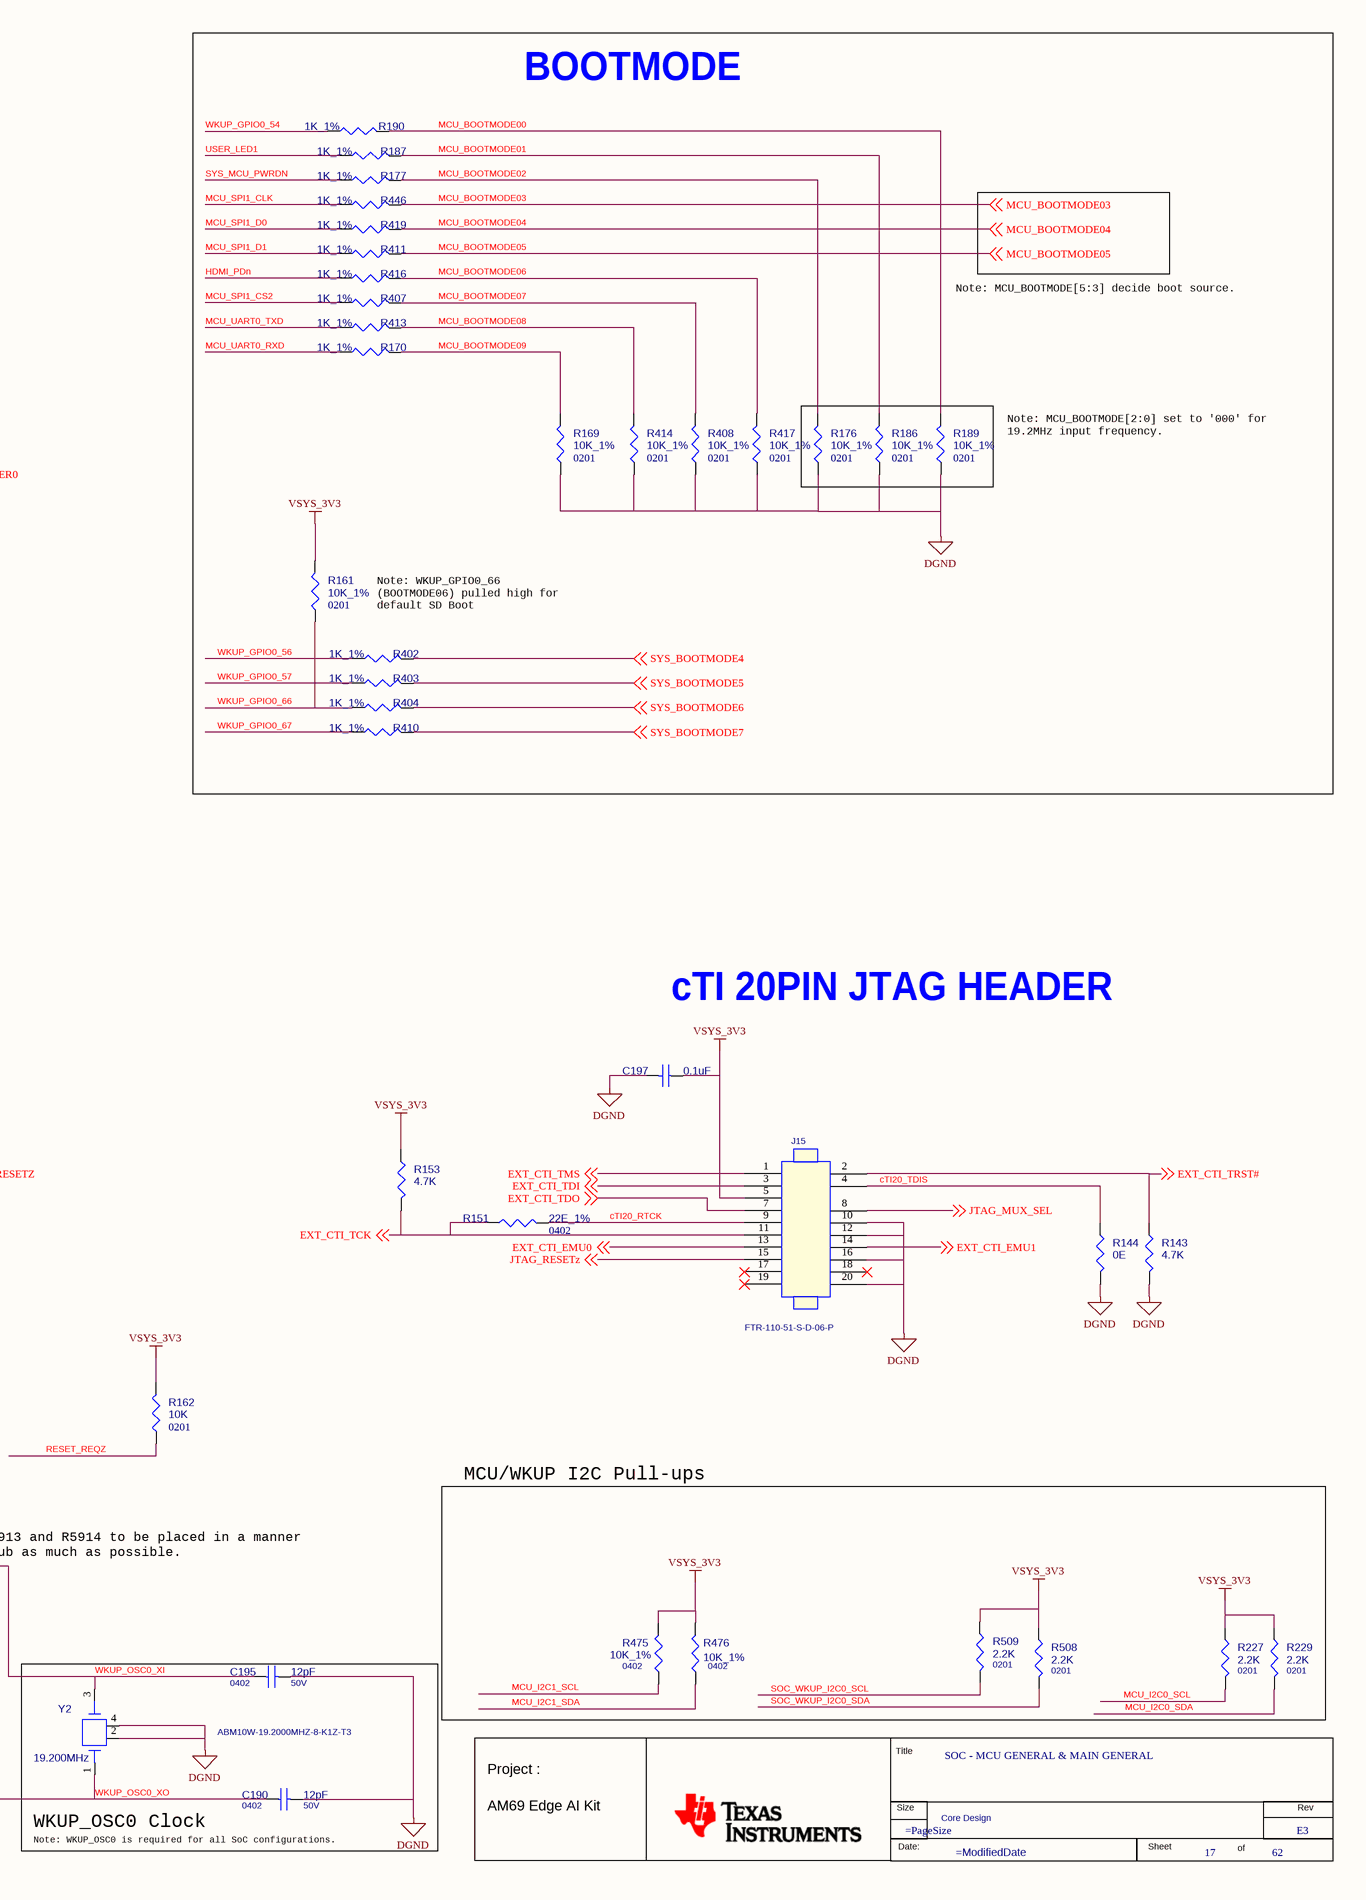
[diagram p25: 17. SOC MCU & MAIN GEN IO, OSC.SchDoc, right]

### Parts
(Parts that share a designator on the sheet are numbered #1, #2 ... from top to bottom, then left to right.)
*#17  RevCode: E3  Title: SOC - MCU GENERAL & MAIN GENERAL  Page Number: 17  Page Count: 62  Variant Name: Core Design  (hidden comment: MISTRAL_TITLEBLK_CSIZE_1)  (graphical)
C190  12pF  Voltage: 50V  Package: 0402  [CAP0402_0-75]
C195  12pF  Voltage: 50V  Package: 0402  [CAP0402_0-75]
C197  0.1uF  [CAP0201_0-5]
C205  12pF  Package: 0402  Voltage: 50V  [CAP0402_0-75]
C209  12pF  Voltage: 50V  Package: 0402  [CAP0402_0-75]
J15  Mfr_part_number: FTR-110-51-S-D-06-P  [HDR_2X10_FTR-110-51-D-06_S_S_8-7]  (hidden comment: HDR_2X10)
R143  4.7K  [RES0201_0-5]
R144  0E  [RES0402_0-5]
R151  22E_1%  Package: 0402  [RES0402_0-5]
R153  4.7K  [RES0201_0-5]
R155  0E  Package: 0402  [RES0402_0-5]
R157  0E  Package: 0402  [RES0402_0-5]
R161  10K_1%  Package: 0201  [RES0201_0-5]
R162  10K  Package: 0201  [RES0201_0-5]
R169  10K_1%  Package: 0201  [RES0201_0-5]
R170  1K_1%  [RES0201_0-5]
R175  2.2K  Package: 0201  [RES0201_0-5]
R176  10K_1%  Package: 0201  [RES0201_0-5]
R177  1K_1%  [RES0201_0-5]
R186  10K_1%  Package: 0201  [RES0201_0-5]
R187  1K_1%  [RES0201_0-5]
R189  10K_1%  Package: 0201  [RES0201_0-5]
R190  1K_1%  [RES0201_0-5]
R227  2.2K  Package: 0201  [RES0201_0-5]
R229  2.2K  Package: 0201  [RES0201_0-5]
R292  0E  [RES0402_0-5]
R309  10K_1%  [RES0402_0-5]
R401  0E  [RES0402_0-5]
R402  1K_1%  [RES0201_0-5]
R403  1K_1%  [RES0201_0-5]
R404  1K_1%  [RES0201_0-5]
R407  1K_1%  [RES0201_0-5]
R408  10K_1%  Package: 0201  [RES0201_0-5]
R410  1K_1%  [RES0201_0-5]
R411  1K_1%  [RES0201_0-5]
R413  1K_1%  [RES0201_0-5]
R414  10K_1%  Package: 0201  [RES0201_0-5]
R416  1K_1%  [RES0201_0-5]
R417  10K_1%  Package: 0201  [RES0201_0-5]
R419  1K_1%  [RES0201_0-5]
R423  10K_1%  [RES0402_0-5]
R446  1K_1%  [RES0201_0-5]
R475  10K_1%  Package: 0402  [RES0402_0-5]
R476  10K_1%  Package: 0402  [RES0402_0-5]
R508  2.2K  Package: 0201  [RES0201_0-5]
R509  2.2K  Package: 0201  [RES0201_0-5]
TP47  TP30_SMD  [TP30_SMD]  (value not drawn)
TP51  TP30_SMD  [TP30_SMD]  (value not drawn)
TP52  TP30_SMD  [TP30_SMD]  (value not drawn)
TP71  TP30_SMD  [TP30_SMD]  (value not drawn)
TP101  TP30_SMD  [TP30_SMD]  (value not drawn)
U28  XJ784S45AALY  [BGA1414_31-49_1230X1230_2-7]  (parts D,I of 26)
Y2  19.200MHz  Mfr_part_number: ABM10W-19.2000MHZ-8-K1Z-T3  [XTAL4_ABM10W_100X80_SMD_0-6]
Y3  26.000MHz  Mfr_part_number: ABM10W-26.0000MHZ-8-K1Z-T3  [XTAL4_ABM10W_100X80_SMD_0-6]

### Blocks framed on the sheet
BOOTMODE: R161 R169 R170 R176 R177 R186 R187 R189 R190 R402-R404 R407 R408 R410 R411 R413 R414 R416 R417 R419 R446
MCU/WKUP I2C Pull-ups: R227 R229 R475 R476 R508 R509
OSC1 Clock: C205 C209 R155 R157 Y3
WKUP_OSC0 Clock: C190 C195 Y2

### Nets
DGND: C190.2 C195.2 C197.2 C205.2 C209.2 J15.10 J15.12 J15.16 J15.20 R143.2 R144.2 R169.1 R176.1 R186.1 R189.1 R309.2 R408.1 R414.1 R417.1 R423.2 TP52.1(TP) Y2.2(GND1) Y2.4(GND2) Y3.2(GND1) Y3.4(GND2)  [project net VDD_CPU_HCPS_GOSNS]
VSYS_3V3: C197.1 J15.5 R153.1 R161.2 R162.1 R175.1 R227.1 R229.1 R475.2 R476.2 R508.1 R509.1  [project net V_3V3]
AUDIO_EXT_REFCLK0: U28.AJ34(PMIC_WAKE0) ; off-sheet AUDIO_EXT_REFCLK0
cTI20_RTCK: J15.9 R151.2
cTI20_TDIS: J15.4 R144.1
EXT_CTI_EMU0: J15.13 ; off-sheet EXT_CTI_EMU0
EXT_CTI_EMU1: J15.14 ; off-sheet EXT_CTI_EMU1
EXT_CTI_TCK: J15.11 R151.1 R153.2 ; off-sheet EXT_CTI_TCK
EXT_CTI_TDI: J15.3 ; off-sheet EXT_CTI_TDI
EXT_CTI_TDO: J15.7 ; off-sheet EXT_CTI_TDO
EXT_CTI_TMS: J15.1 ; off-sheet EXT_CTI_TMS
EXT_CTI_TRST#: J15.2 R143.1 ; off-sheet EXT_CTI_TRST#
HDMI_LS_OE: R292.1 U28.L33(WKUP_GPIO0_10) ; off-sheet HDMI_LS_OE
HDMI_PDn: R416.2 U28.H37(WKUP_GPIO0_14) ; off-sheet HDMI_PDn
JTAG_MUX_SEL: J15.8 ; off-sheet JTAG_MUX_SEL
JTAG_RESETz: J15.15 ; off-sheet JTAG_RESETz
MCU_ADC_EXT_TRIGGER0: R292.2 ; off-sheet MCU_ADC_EXT_TRIGGER0
MCU_BOOTMODE00: R189.2 R190.1
MCU_BOOTMODE01: R186.2 R187.1
MCU_BOOTMODE02: R176.2 R177.1
MCU_BOOTMODE03: R446.1 ; off-sheet MCU_BOOTMODE03
MCU_BOOTMODE04: R419.1 ; off-sheet MCU_BOOTMODE04
MCU_BOOTMODE05: R411.1 ; off-sheet MCU_BOOTMODE05
MCU_BOOTMODE06: R416.1 R417.2
MCU_BOOTMODE07: R407.1 R408.2
MCU_BOOTMODE08: R413.1 R414.2
MCU_BOOTMODE09: R169.2 R170.1
MCU_CLKOUT0: U28.M38(WKUP_GPIO0_11) ; off-sheet MCU_CLKOUT0
MCU_I2C0_SCL: R227.2 U28.M35(MCU_I2C0_SCL) ; off-sheet MCU_I2C0_SCL
MCU_I2C0_SDA: R229.2 U28.G34(MCU_I2C0_SDA) ; off-sheet MCU_I2C0_SDA
MCU_I2C1_SCL: R475.1 U28.L35(WKUP_GPIO0_8) ; off-sheet MCU_I2C1_SCL
MCU_I2C1_SDA: R476.1 U28.L34(WKUP_GPIO0_9) ; off-sheet MCU_I2C1_SDA
MCU_MCAN0_RX: U28.F38(MCU_MCAN0_RX) ; off-sheet MCU_MCAN0_RX
MCU_MCAN0_TX: U28.K33(MCU_MCAN0_TX) ; off-sheet MCU_MCAN0_TX
MCU_MCAN1_RX: U28.K36(WKUP_GPIO0_5) ; off-sheet MCU_MCAN1_RX
MCU_MCAN1_TX: U28.H35(WKUP_GPIO0_4) ; off-sheet MCU_MCAN1_TX
MCU_PORZ: R401.2 U28.K32(MCU_PORZ) ; off-sheet PORZ, off-sheet MCU_PORZ  [also labelled PORZ]
MCU_RESETSTATZ: R423.1 TP51.1(TP) U28.F36(MCU_RESETSTATZ) ; off-sheet MCU_RESETSTATZ
MCU_RESETZ: R175.2 U28.G36(MCU_RESETZ) ; off-sheet MCU_RESETZ
MCU_SAFETY_ERRZ: TP71.1(TP) U28.N36(MCU_SAFETY_ERRORN) ; off-sheet MCU_SAFETY_ERRZ
MCU_SPI1_CLK: R446.2 U28.H38(WKUP_GPIO0_0) ; off-sheet MCU_SPI1_CLK
MCU_SPI1_CS0: U28.J36(WKUP_GPIO0_3) ; off-sheet MCU_SPI1_CS0
MCU_SPI1_CS2: R407.2 U28.K37(WKUP_GPIO0_15) ; off-sheet MCU_SPI1_CS2
MCU_SPI1_D0: R419.2 U28.J34(WKUP_GPIO0_1) ; off-sheet MCU_SPI1_D0
MCU_SPI1_D1: R411.2 U28.J35(WKUP_GPIO0_2) ; off-sheet MCU_SPI1_D1
MCU_UART0_RXD: R170.2 U28.K38(WKUP_GPIO0_13) ; off-sheet MCU_UART0_RXD
MCU_UART0_TXD: R413.2 U28.J37(WKUP_GPIO0_12) ; off-sheet MCU_UART0_TXD
OSC1_XI: R155.1 U28.P38(OSC1_XI)
OSC1_XO: R157.1 U28.N37(OSC1_XO)
RESET_REQZ: R162.2 TP47.1(TP) U28.F34(RESET_REQZ)
RESETSTATZ: R309.1 TP101.1(TP) U28.AL38(RESETSTATZ) ; off-sheet RESETSTATZ
SOC_SAFETY_ERRZ: U28.AM34(SOC_SAFETY_ERRORN) ; off-sheet SOC_SAFETY_ERRZ
SOC_WKUP_I2C0_SCL: R509.2 U28.N33(WKUP_I2C0_SCL) ; off-sheet SOC_WKUP_I2C0_SCL
SOC_WKUP_I2C0_SDA: R508.2 U28.N35(WKUP_I2C0_SDA) ; off-sheet SOC_WKUP_I2C0_SDA
SYS_BOOTMODE4: R402.1 ; off-sheet SYS_BOOTMODE4
SYS_BOOTMODE5: R403.1 ; off-sheet SYS_BOOTMODE5
SYS_BOOTMODE6: R404.1 ; off-sheet SYS_BOOTMODE6
SYS_BOOTMODE7: R410.1 ; off-sheet SYS_BOOTMODE7
SYS_MCU_PWRDN: R177.2 U28.J38(MCU_SPI0_D1) ; off-sheet SYS_MCU_PWRDN
USER_LED1: R187.2 U28.H36(MCU_SPI0_D0) ; off-sheet USER_LED1
WKUP_GPIO0_49: U28.M33(WKUP_GPIO0_49) ; off-sheet WKUP_GPIO0_49
WKUP_GPIO0_54: R190.2 U28.G38(MCU_SPI0_CLK) ; off-sheet WKUP_GPIO0_54
WKUP_GPIO0_56: R402.2 U28.M37(WKUP_GPIO0_56) ; off-sheet WKUP_GPIO0_56
WKUP_GPIO0_57: R403.2 U28.M36(WKUP_GPIO0_57) ; off-sheet WKUP_GPIO0_57
WKUP_GPIO0_66: R161.1 R404.2 U28.N34(WKUP_GPIO0_66) ; off-sheet WKUP_GPIO0_66
WKUP_GPIO0_67: R410.2 U28.M34(WKUP_GPIO0_67) ; off-sheet WKUP_GPIO0_67
WKUP_GPIO0_70: U28.F37(MCU_SPI0_CS0) ; off-sheet WKUP_GPIO0_70
WKUP_GPIO0_88: U28.L38(PMIC_POWER_EN1) ; off-sheet WKUP_GPIO0_88
WKUP_OSC0_XI: C195.1 U28.T38(WKUP_OSC0_XI) Y2.3
WKUP_OSC0_XO: C190.1 U28.U37(WKUP_OSC0_XO) Y2.1
WKUP_UART0_CTSn: U28.L37(WKUP_GPIO0_6) ; off-sheet WKUP_UART0_CTSn
WKUP_UART0_RTSn: U28.L36(WKUP_GPIO0_7) ; off-sheet WKUP_UART0_RTSn
WKUP_UART0_RXD: U28.K35(WKUP_UART0_RXD) ; off-sheet WKUP_UART0_RXD
WKUP_UART0_TXD: U28.K34(WKUP_UART0_TXD) ; off-sheet WKUP_UART0_TXD
NetC205_1: C205.1 R155.2 Y3.3
NetC209_1: C209.1 R157.2 Y3.1
NetR401_1: R401.1 U28.P33(PORZ)

Not connected (* = marked no-connect by the designer): J15 17* 18* 19*

### Notes on the sheet
- MCU & MAIN GENERAL IO, OSC CLKS
- (near U28) WKUP_GPIO0_69
- (near U28) MCU_BOOTMODE01
- Note: MCU_BOOTMODE[5:3] decide boot source.
- WKUP_GPIO0_6
- Note: MCU_BOOTMODE[2:0] set to '000' for
  19.2MHz input frequency.
- WKUP_GPIO0_7
- (near U28) MCU_OBSCLK0
- Note: WKUP_GPIO0_66
  (BOOTMODE06) pulled high for
  default SD Boot
- CONTROL & OSC
- cTI 20PIN JTAG HEADER
- CAD Note: R5913 and R5914 to be placed in a manner
  to reduce stub as much as possible.
- Note: OSC1 is OPTIONAL, provides second clock frequency for SoC.
- (near C190) Note: WKUP_OSC0 is required for all SoC configurations.
- (in symbol J7AHPSoC-EVM_BGA1414, part D) CNTRL & OSC / ------------------; (VDDSHV0_MCU); (VDDA_WKUP); (VDDSHV0); (VDDSHV2); (VDDA_OSC1); General PN: J784S4 / SR1.0 / Symbol: v1.1 / BGA Map: v1.0 / TDA4xx DM: v<tbd>
- (in symbol J7AHPSoC-EVM_BGA1414, part I) MCU General IO / ----------------------; (VDDSHV0_MCU); General PN: J784S4 / SR1.0 / Symbol: v1.1 / BGA Map: v1.0 / TDA4xx DM: v<tbd>
- (in symbol MISTRAL_TITLEBLK_CSIZE_1) Title; Project :; Size; Rev; AM69 Edge AI Kit; Date:; Sheet; of